# Altium schematic sheet PWM_BoardSchem.SchDoc
size A; SheetNumber: 2; SheetTotal: 6
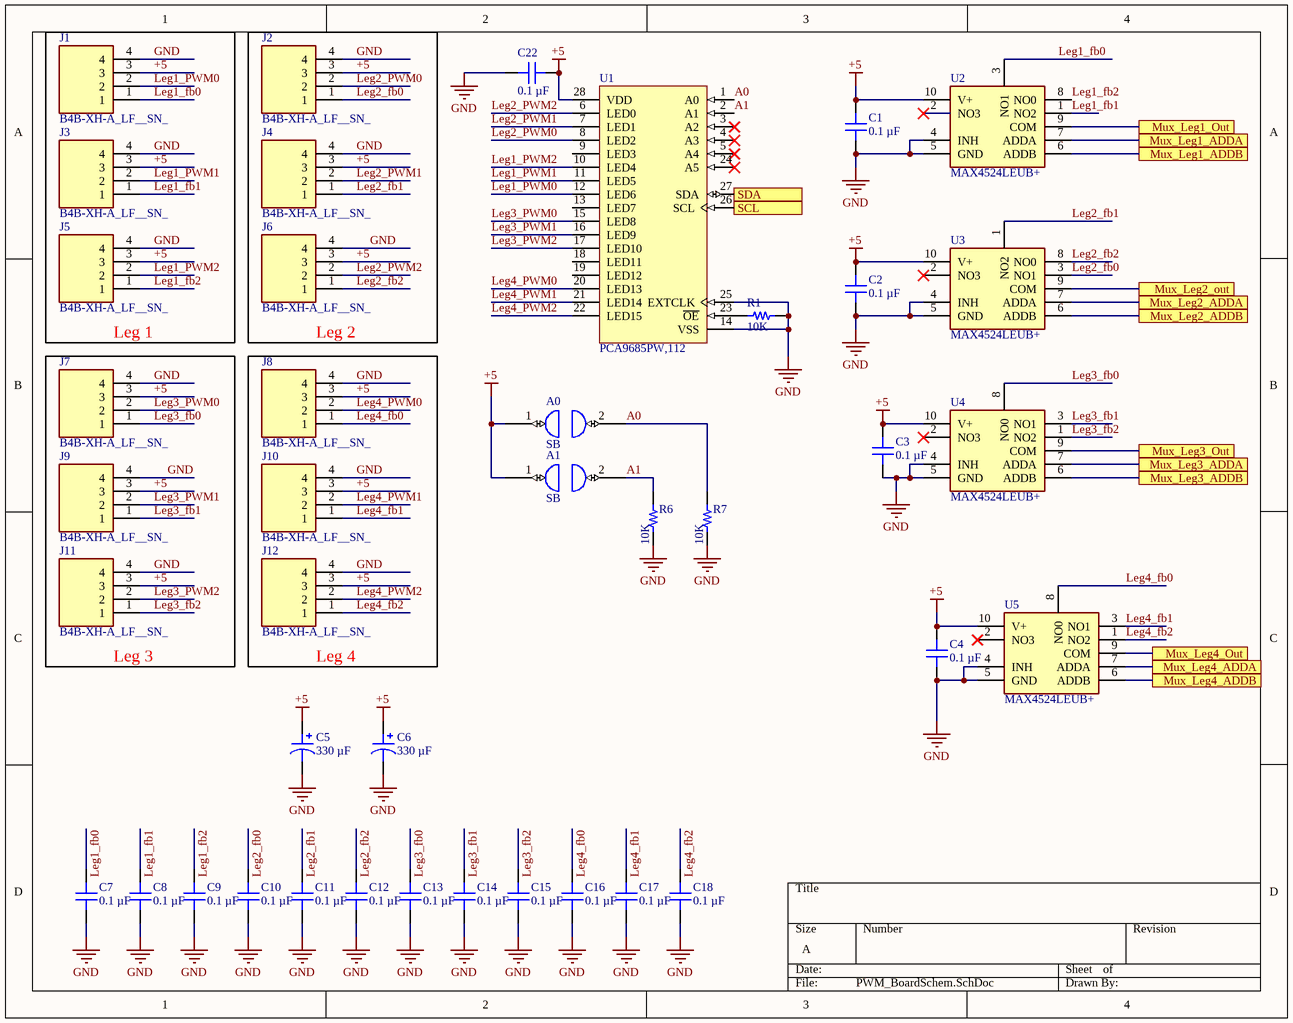
[diagram p0: PWM_BoardSchem.SchDoc]

## Parts
A0  SB  [CAPC2010X06N]
A1  SB  [CAPC2010X06N]
C1  0.1 µF  [CAP 1206_3216 - 0.8MM]
C2  0.1 µF  [CAP 1206_3216 - 0.8MM]
C3  0.1 µF  [CAP 1206_3216 - 0.8MM]
C4  0.1 µF  [CAP 1206_3216 - 0.8MM]
C5  330 µF  [CAP TH ALPOLY D8.00mm S3.50mm H9.00mm]
C6  330 µF  [CAP TH ALPOLY D8.00mm S3.50mm H9.00mm]
C7  0.1 µF  [CAP 1206_3216 - 0.8MM]
C8  0.1 µF  [CAP 1206_3216 - 0.8MM]
C9  0.1 µF  [CAP 1206_3216 - 0.8MM]
C10  0.1 µF  [CAP 1206_3216 - 0.8MM]
C11  0.1 µF  [CAP 1206_3216 - 0.8MM]
C12  0.1 µF  [CAP 1206_3216 - 0.8MM]
C13  0.1 µF  [CAP 1206_3216 - 0.8MM]
C14  0.1 µF  [CAP 1206_3216 - 0.8MM]
C15  0.1 µF  [CAP 1206_3216 - 0.8MM]
C16  0.1 µF  [CAP 1206_3216 - 0.8MM]
C17  0.1 µF  [CAP 1206_3216 - 0.8MM]
C18  0.1 µF  [CAP 1206_3216 - 0.8MM]
C22  0.1 µF  [CAP 1206_3216 - 0.8MM]
J1  B4B-XH-A_LF__SN_  [B4BXHALFSN]
J2  B4B-XH-A_LF__SN_  [B4BXHALFSN]
J3  B4B-XH-A_LF__SN_  [B4BXHALFSN]
J4  B4B-XH-A_LF__SN_  [B4BXHALFSN]
J5  B4B-XH-A_LF__SN_  [B4BXHALFSN]
J6  B4B-XH-A_LF__SN_  [B4BXHALFSN]
J7  B4B-XH-A_LF__SN_  [B4BXHALFSN]
J8  B4B-XH-A_LF__SN_  [B4BXHALFSN]
J9  B4B-XH-A_LF__SN_  [B4BXHALFSN]
J10  B4B-XH-A_LF__SN_  [B4BXHALFSN]
J11  B4B-XH-A_LF__SN_  [B4BXHALFSN]
J12  B4B-XH-A_LF__SN_  [B4BXHALFSN]
R1  10K  [RES 1206_3216]
R6  10K  [RES 1206_3216]
R7  10K  [RES 1206_3216]
U1  PCA9685PW,112  [SOT361-1_V]
U2  MAX4524LEUB+  [SOP50P490X110-10N]
U3  MAX4524LEUB+  [SOP50P490X110-10N]
U4  MAX4524LEUB+  [SOP50P490X110-10N]
U5  MAX4524LEUB+  [SOP50P490X110-10N]

## Blocks framed on the sheet
Leg 1: J1 J3 J5
Leg 2: J2 J4 J6
Leg 3: J7 J9 J11
Leg 4: J8 J10 J12

## Ports
Mux_Leg1_ADDA, Mux_Leg1_ADDB, Mux_Leg1_Out, Mux_Leg2_ADDA, Mux_Leg2_ADDB, Mux_Leg2_out, Mux_Leg3_ADDA, Mux_Leg3_ADDB, Mux_Leg3_Out, Mux_Leg4_ADDA, Mux_Leg4_ADDB, Mux_Leg4_Out, SCL, SDA

## Nets
+5: A0.1 A1.1 C1.2 C2.2 C3.2 C4.2 C5.1 C6.1 C22.1 J1.3 J2.3 J3.3 J4.3 J5.3 J6.3 J7.3 J8.3 J9.3 J10.3 J11.3 J12.3 U1.28(VDD) U2.10(V+) U3.10(V+) U4.10(V+) U5.10(V+)
GND: C1.1 C2.1 C3.1 C4.1 C5.2 C6.2 C7.1 C8.1 C9.1 C10.1 C11.1 C12.1 C13.1 C14.1 C15.1 C16.1 C17.1 C18.1 C22.2 J1.4 J2.4 J3.4 J4.4 J5.4 J6.4 J7.4 J8.4 J9.4 J10.4 J11.4 J12.4 R1.2 R6.1 R7.1 U1.14(VSS) U1.25(EXTCLK) U2.4(INH) U2.5(GND) U3.4(INH) U3.5(GND) U4.4(INH) U4.5(GND) U5.4(INH) U5.5(GND)
A0: A0.2 R7.2 U1.1(A0)
A1: A1.2 R6.2 U1.2(A1)
Leg1_fb0: C7.2 J1.1 U2.3(NO1)
Leg1_fb1: C8.2 J3.1 U2.1(NO2)
Leg1_fb2: C9.2 J5.1 U2.8(NO0)
Leg1_PWM0: J1.2 U1.12(LED6)
Leg1_PWM1: J3.2 U1.11(LED5)
Leg1_PWM2: J5.2 U1.10(LED4)
Leg2_fb0: C10.2 J2.1 U3.3(NO1)
Leg2_fb1: C11.2 J4.1 U3.1(NO2)
Leg2_fb2: C12.2 J6.1 U3.8(NO0)
Leg2_PWM0: J2.2 U1.8(LED2)
Leg2_PWM1: J4.2 U1.7(LED1)
Leg2_PWM2: J6.2 U1.6(LED0)
Leg3_fb0: C13.2 J7.1 U4.8(NO0)
Leg3_fb1: C14.2 J9.1 U4.3(NO1)
Leg3_fb2: C15.2 J11.1 U4.1(NO2)
Leg3_PWM0: J7.2 U1.15(LED8)
Leg3_PWM1: J9.2 U1.16(LED9)
Leg3_PWM2: J11.2 U1.17(LED10)
Leg4_fb0: C16.2 J8.1 U5.8(NO0)
Leg4_fb1: C17.2 J10.1 U5.3(NO1)
Leg4_fb2: C18.2 J12.1 U5.1(NO2)
Leg4_PWM0: J8.2 U1.20(LED13)
Leg4_PWM1: J10.2 U1.21(LED14)
Leg4_PWM2: J12.2 U1.22(LED15)
Mux_Leg1_ADDA: U2.7(ADDA) ; port Mux_Leg1_ADDA
Mux_Leg1_ADDB: U2.6(ADDB) ; port Mux_Leg1_ADDB
Mux_Leg1_Out: U2.9(COM) ; port Mux_Leg1_Out
Mux_Leg2_ADDA: U3.7(ADDA) ; port Mux_Leg2_ADDA
Mux_Leg2_ADDB: U3.6(ADDB) ; port Mux_Leg2_ADDB
Mux_Leg2_out: U3.9(COM) ; port Mux_Leg2_out
Mux_Leg3_ADDA: U4.7(ADDA) ; port Mux_Leg3_ADDA
Mux_Leg3_ADDB: U4.6(ADDB) ; port Mux_Leg3_ADDB
Mux_Leg3_Out: U4.9(COM) ; port Mux_Leg3_Out
Mux_Leg4_ADDA: U5.7(ADDA) ; port Mux_Leg4_ADDA
Mux_Leg4_ADDB: U5.6(ADDB) ; port Mux_Leg4_ADDB
Mux_Leg4_Out: U5.9(COM) ; port Mux_Leg4_Out
SCL: U1.26(SCL) ; port SCL
SDA: U1.27(SDA) ; port SDA
NetR1_1: R1.1 U1.23(~{OE})

Not connected (* = marked no-connect by the designer): U1 3(A2)* 4(A3)* 5(A4)* 9(LED3) 13(LED7) 18(LED11) 19(LED12) 24(A5)*; U2 2(NO3)*; U3 2(NO3)*; U4 2(NO3)*; U5 2(NO3)*

## Library data of the parts
A0 A1 = CMP-00004-5: Solder Bridge/0 ohm
C1-C4 C7-C18 C22 = CC1206ZRY5V9BB104: CAP CER 0.1UF 50V Y5V 1206; manufacturer: Yageo; Temperature Coefficient: Y5V (F); Tolerance: -20%, +80%; Part Number: CC1206ZRY5V9BB104; Value: 0.1 µF; Applications: General Purpose; Capacitance: 0.1 µF; componentlink1description: Datasheet; componentlink1url: http://www.yageo.com/NewPortal/_en/search/productDocs.jsp?YageoPartNumber=CC1206ZRY5V9BB104; componentlink2description: DigiKey Link; componentlink2url: https://www.digikey.com/en/products/detail/yageo/CC1206ZRY5V9BB104/5884687; Device Package: 1206 (3216 Metric); lastupdated: 9/19/2022 1:06:25 PM; Lifecycle Status: Active; Minimum Order: 1; Mounting Type: Surface Mount, MLCC; Operating Temperature: -30°C ~ 85°C; Package / Case: 1206 (3216 Metric); packaging: TapeAndReel; partid: 18813; Part Status: Active; price: 0.04; series: CC; Size / Dimension: 0.126" L x 0.063" W (3.20mm x 1.60mm); Supplier 1: DigiKey; Supplier Part Number 1: 311-4505-1-ND; Thickness (Max): 0.028" (0.70mm); Voltage - Rated: 50V
C5 C6 = RL81C331MDN1KX: CAP ALUM POLY 330UF 20% 16V T/H; manufacturer: Nichicon; ESR (Equivalent Series Resistance): 12mOhm; Lifetime @ Temp.: 2000 Hrs @ 105°C; Ripple Current @ High Frequency: 5 A @ 100 kHz; Ripple Current @ Low Frequency: 500 mA @ 120 Hz; Type: Polymer; Part Number: RL81C331MDN1KX; Value: 330 µF; Applications: General Purpose; Capacitance: 330 µF; componentlink1description: Datasheet; componentlink1url: http://nichicon-us.com/english/products/pdfs/e-rl8.pdf; componentlink2description: DigiKey Link; componentlink2url: https://www.digikey.com/en/products/detail/nichicon/RL81C331MDN1KX/3465929; Device Package: Radial, Can; Height - Seated (Max): 0.354" (9.00mm); lastupdated: 9/19/2022 2:07:31 PM; Lead Spacing: 0.138" (3.50mm); Lifecycle Status: Active; Minimum Order: 1; Mounting Type: Through Hole; Operating Temperature: -55°C ~ 105°C; Package / Case: Radial, Can; packaging: TapeAndBox; partid: 3754; Part Status: Active; price: 0.43; series: FPCAP, RL8; Size / Dimension: 0.315" Dia (8.00mm); Supplier 1: DigiKey; Supplier Part Number 1: 493-6629-1-ND; Tolerance: ±20%; Voltage - Rated: 16 V
J1-J12 = B4B-XH-A_LF__SN_: Connector; Manufacturer_Name: JST (JAPAN SOLDERLESS TERMINALS); Manufacturer_Part_Number: B4B-XH-A(LF)(SN); Datasheet Link: https://datasheet.lcsc.com/szlcsc/JST-Sales-America-B4B-XH-A-LF-SN_C144395.pdf; Height: 7mm; Arrow Part Number: B4B-XH-A(LF)(SN); Arrow Price/Stock: https://www.arrow.com/en/products/b4b-xh-a-lf-sn/jst-manufacturing
R1 R6 R7 = ESR18EZPF1002: RES SMD 10K OHM 1% 1/2W 1206; Manufacturer: Rohm Semiconductor; Power (Watts): 0.5W, 1/2W; Resistance: 10 kOhms; Temperature Coefficient: ±100ppm/°C; Value: 10 kOhms; Part Number: ESR18EZPF1002; ComponentLink1Description: Datasheet; ComponentLink1URL: https://www.rohm.com/datasheet/ESR01MZPF/esr-e; ComponentLink2Description: DigiKey Link; ComponentLink2URL: https://www.digikey.com/en/products/detail/rohm-semiconductor/ESR18EZPF1002/1983592; Composition: Thick Film; Device Package: 1206 (3216 Metric); Features: Automotive AEC-Q200, Pulse Withstanding; Height - Seated (Max): 0.026" (0.65mm); LastUpdated: 9/19/2022 1:29:57 PM; Lifecycle Status: Active; Minimum Order: 1; Number of Terminations: 2; Operating Temperature: -55°C ~ 155°C; Package / Case: 1206 (3216 Metric); Packaging: TapeAndReel; PartId: 26965; Part Status: Active; Price: 0.02; Ratings: AEC-Q200; Series: ESR; Size / Dimension: 0.126" L x 0.063" W (3.20mm x 1.60mm); Supplier 1: DigiKey; Supplier Part Number 1: RHM10.0KAFCT-ND; Supplier Device Package: 1206; Tolerance: ±1%
U1 = CMP-1595-00004-2: 16-Channel, 12-Bit PWM Fm+ I2C-Bus LED Controller, 2.3 to 5.5 V, -40 to 85 degC, 28-Pin TSSOP (SOT361-1), RoHS, Tape and Reel; Supply Current Max: 10 mA; Supply Voltage Min: 2.3 V; Supply Voltage Max: 5.5 V; Frequency: 25000000 Hz; Temperature Min: -40 degC; PackageDescription: 28-Pin Small Outline Package, Body 9.7 x 4.4 mm, Pitch 0.65 mm; RoHS: TRUE; ComponentLink1Description: Manufacturer URL; Code_JEDEC: MO-153; PartNumber: PCA9685; ComponentLink2URL: http://www.nxp.com/documents/data_sheet/PCA9685.pdf; Packing: Tape and Reel; ComponentLink1URL: http://www.nxp.com/; ComponentLink3Description: Package Specification; ComponentLink2Description: Datasheet; ComponentLink3URL: http://www.nxp.com/documents/outline_drawing/sot361-1_po.pdf; DatasheetVersion: Rev. 4; Temperature Max: 85 degC; PackageVersion: 02/2003; Mounting Technology: Surface Mount
U2-U5 = MAX4524LEUB+: Integrated Circuit; Manufacturer_Name: Maxim Integrated; Datasheet Link: https://datasheets.maximintegrated.com/en/ds/MAX4524L-MAX4525L.pdf; Height: 1.1mm; Manufacturer_Part_Number: MAX4524LEUB+; Mouser Part Number: 700-MAX4524LEUB+; Mouser Price/Stock: https://www.mouser.co.uk/ProductDetail/Maxim-Integrated/MAX4524LEUB%2b?qs=Mc2rGIXtnyWlO7eYhLJKZQ%3D%3D